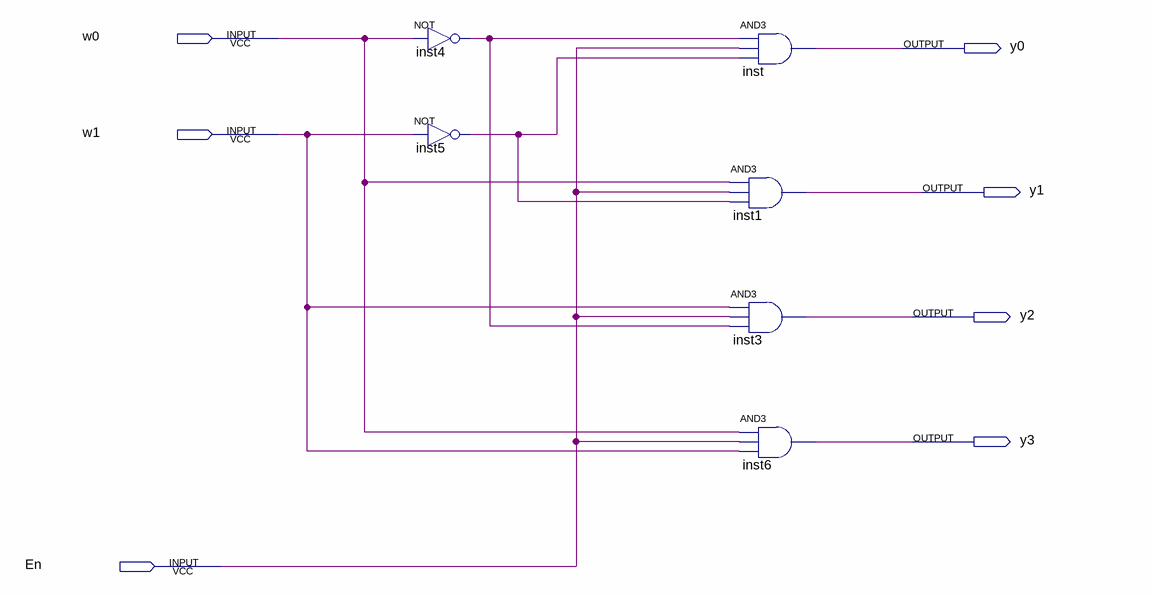
[diagram p0: schematic sheet]
// Quartus schematic 2_to_4_decoder.bdf as structural Verilog: 6 symbols, 7 pins
module \2_to_4_decoder  (
  input  w0,
  input  w1,
  input  En,
  output y0,
  output y1,
  output y2,
  output y3
);

  wire inst4_out, inst5_out;

  not inst4 (inst4_out, w0);
  not inst5 (inst5_out, w1);
  and inst (y0, inst4_out, En, inst5_out);
  and inst1 (y1, w0, En, inst5_out);
  and inst3 (y2, w1, En, inst4_out);
  and inst6 (y3, w0, En, w1);
endmodule
